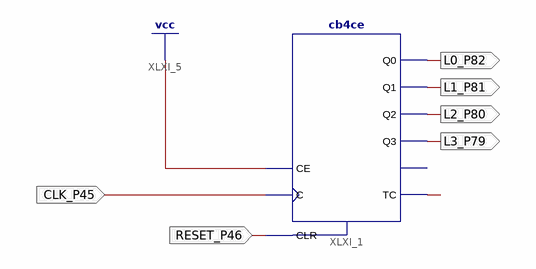
[diagram p0: schematic sheet 1]
// Xilinx ISE schematic CounterTest.sch (spartan6) as structural Verilog: 1 symbols, 6 ports
module CounterTest (
  input  CLK_P45,
  input  RESET_P46,
  output L0_P82,
  output L1_P81,
  output L2_P80,
  output L3_P79
);

  wire L4_78;

  cb4ce XLXI_1 (
    .C(CLK_P45), .CE(1'b1), .CLR(RESET_P46), .Q0(L0_P82), .Q1(L1_P81), .Q2(L2_P80), .Q3(L3_P79), .TC(L4_78));  // open: CEO

  // Notes on the sheet:
  //   CLOCK_DEDICATED_ROUTE on signal CLK_P45 = TRUE
endmodule
